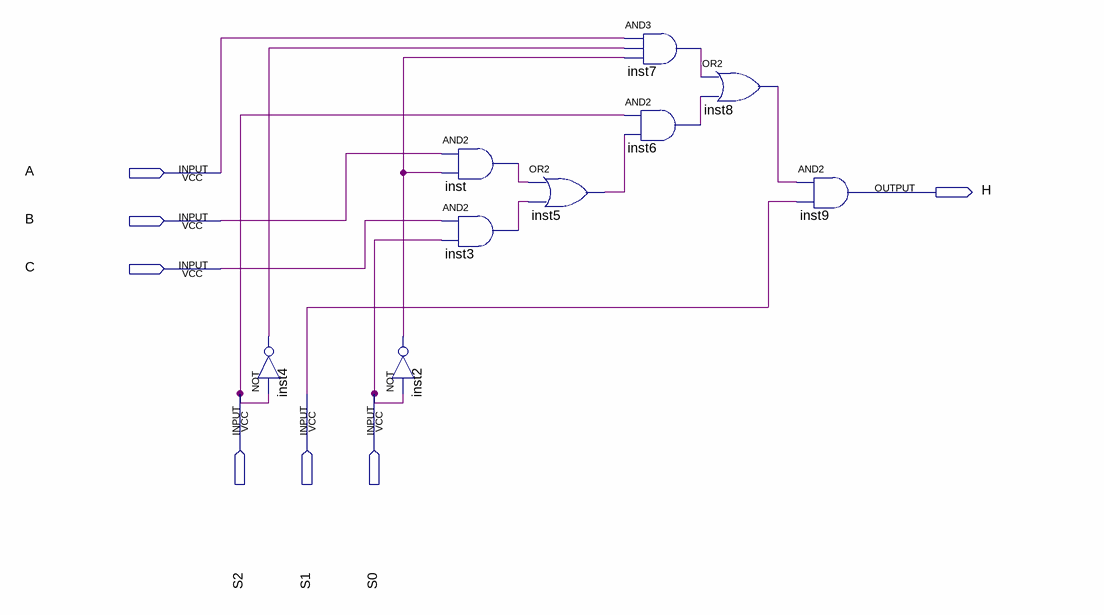
[diagram p0: schematic sheet]
// Quartus schematic DEC_S3_Part.bdf as structural Verilog: 9 symbols, 7 pins
module DEC_S3_Part (
  input  A,
  input  B,
  input  C,
  input  S2,
  input  S1,
  input  S0,
  output H
);

  wire inst2_out, inst3_out, inst4_out, inst5_out, inst6_out, inst7_out, inst8_out, inst_out;

  not inst4 (inst4_out, S2);
  not inst2 (inst2_out, S0);
  and inst (inst_out, B, inst2_out);
  and inst3 (inst3_out, C, S0);
  or inst5 (inst5_out, inst_out, inst3_out);
  and inst7 (inst7_out, A, inst4_out, inst2_out);
  and inst6 (inst6_out, S2, inst5_out);
  or inst8 (inst8_out, inst7_out, inst6_out);
  and inst9 (H, inst8_out, S1);
endmodule
